# EAGLE design multicharger-redux (EAGLE 9.6.2)
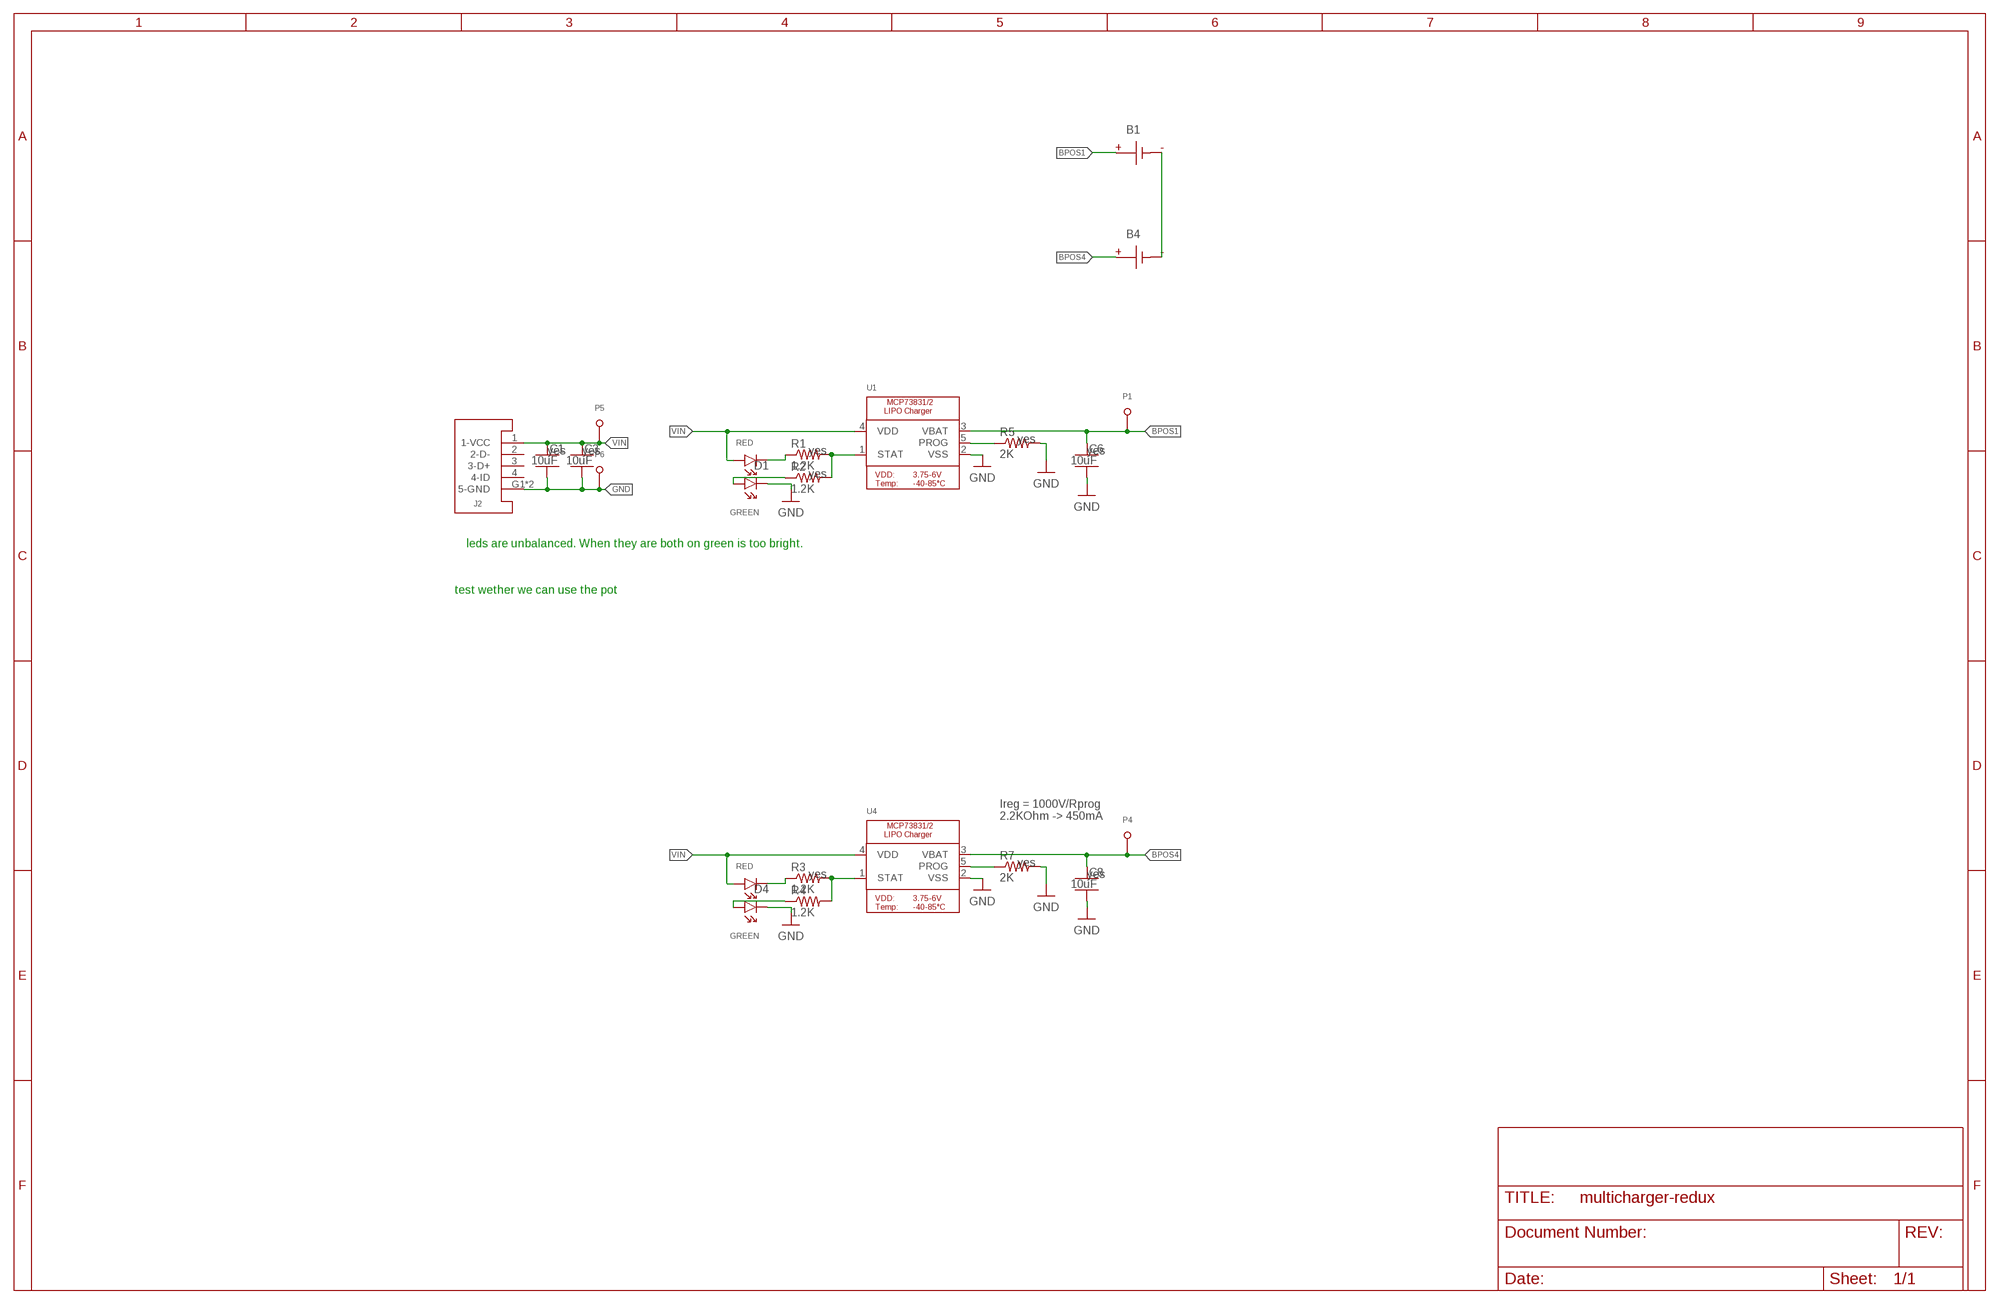
[diagram p0: schematic, sheet 1]
FRAME1 (FRAME_B_L): CREATOR: Unknown; DIST: Unknown; DISTPN: Unknown

## Parts
B1  BATTERY-SMD  [MOLEX-BATTERY-CONNECTOR-SMD-51005-2P]
B4  BATTERY-SMD  [MOLEX-BATTERY-CONNECTOR-SMD-51005-2P]
C1  10uF  CAPACITOR-NP_SMD-2012-0805_CERAMIC-10UF  [CAPC2012X140_HS]
C3  10uF  CAPACITOR-NP_SMD-2012-0805_CERAMIC-10UF  [CAPC2012X140_HS]
C6  10uF  CAPACITOR-NP_SMD-2012-0805_CERAMIC-10UF  [CAPC2012X140_HS]
C8  10uF  CAPACITOR-NP_SMD-2012-0805_CERAMIC-10UF  [CAPC2012X140_HS]
D1  LED-2X-GREEN/RED-1.6X1.5MM  [LED-2X-LITE-ON-1.6MMX1.5MM]
D4  LED-2X-GREEN/RED-1.6X1.5MM  [LED-2X-LITE-ON-1.6MMX1.5MM]
J2  USB-A-SMD-KEYSTONE-931  [USB-A-KEYSTONE-931]
P1  TEST-POINT-1MM  [TEST-POINT-1MM-VIA]
P4  TEST-POINT-1MM  [TEST-POINT-1MM-VIA]
P5  TEST-POINT-1MM  [TEST-POINT-1MM-VIA]
P6  TEST-POINT-1MM  [TEST-POINT-1MM-VIA]
R1  1.2K  RESISTOR_SMD-2012-0805-1.2K  [RESC2012X60_HS]
R2  1.2K  RESISTOR_SMD-2012-0805-1.2K  [RESC2012X60_HS]
R3  1.2K  RESISTOR_SMD-2012-0805-1.2K  [RESC2012X60_HS]
R4  1.2K  RESISTOR_SMD-2012-0805-1.2K  [RESC2012X60_HS]
R5  2K  RESISTOR_SMD-2012-0805-2K  [RESC2012X60_HS]
R7  2K  RESISTOR_SMD-2012-0805-2K  [RESC2012X60_HS]
U1  MCP73831T-2ACI/OT  MCP73831/2  [SOT23-5]
U4  MCP73831T-2ACI/OT  MCP73831/2  [SOT23-5]

## Nets
BPOS1 [LONG_PWR]: B1.P C6.1 P1.T U1.3(VBAT)
BPOS4 [LONG_PWR]: B4.P C8.1 P4.T U4.3(VBAT)
GND [LONG_PWR]: B1.G2(N) B1.G3(N) B1.G(N) B4.G2(N) B4.G3(N) B4.G(N) C1.2 C3.2 C6.2 C8.2 D1.C1 D4.C1 J2.G1(5-GND) J2.G2(5-GND) P6.T R5.2 R7.2 U1.2(VSS) U4.2(VSS)
N$1: D1.A1 R2.1
N$2: D1.C2 R1.1
N$11: R1.2 R2.2 U1.1(STAT)
N$12: R5.1 U1.5(PROG)
N$13: R3.2 R4.2 U4.1(STAT)
N$14: R7.1 U4.5(PROG)
N$15: D4.A1 R4.1
N$16: D4.C2 R3.1
VIN [LONG_PWR]: C1.1 C3.1 D1.A2 D4.A2 J2.1(1-VCC) P5.T U1.4(VDD) U4.4(VDD)
Unconnected: J2.2(2-D-) J2.3(3-D+) J2.4(4-ID)

## Notes on the sheet
- leds are unbalanced. When they are both on green is too bright.
- test wether we can use the pot
- Ireg = 1000V/Rprog
  2.2KOhm -> 450mA

## Library data of the parts
B1 B4 = quadparts_prebuilt:BATTERY: Connections for a battery.; CREATOR: Swanson; DESC: Surface mount battery connector; DIST: ALIBABA; DISTPN: https://www.alibaba.com/product-detail/Molex-51005-51006-2-pin-female_60863668004.html?spm=a2700.7724857.normalList.97.20ef28e64nZnNK; MFR: UNKNOWN; MOUNTING: SMD; MPN: UNKNOWN
C1 C3 C6 C8 = quadparts_prebuilt:CAPACITOR-NP_: Nonpolarized capacitor; CREATOR: Swanson; DESC: CAP CER 10UF 25V X5R 0805; DIST: Digikey; DISTPN: 445-5984-1-ND; MFR: TDK; MOUNTING: SMD; MPN: C2012X5R1E106K125AB; REVIEWER: Swanson; SUBSTITUTE_OK: yes
D1 D4 = RemoteParts:LED-2X; COLOR1: RED; COLOR2: GREEN; CREATOR: Swanson; DESC: LED GREEN/RED CLEAR CHIP SMD; DIST: DIGIKEY; DISTPN: 160-2252-1-ND; MFR: Lite-On Inc.; MOUNTING: SMD; MPN: LTST-C195TGKRKT; PACKAGE: 4SMD
J2 = RemoteParts:USB; CREATOR: Swanson; DESC: CONN PLUG USB2.0 TYPEA 4P SMD RA; DIST: DIGIKEY; DISTPN: 36-931-ND; MFR: Keystone Electronics; MOUNTING: SMD; MPN: 931
P1 P4-P6 = RemoteParts:TEST-POINT; CREATOR: Swanson; DIST: NA; DISTPN: NA; MOUNTING: NA; POPULATE: NO
R1-R3 = quadparts_prebuilt:RESISTOR_: Resistor; CREATOR: Swanson; DESC: RES SMD 1.2K OHM 1% 1/8W 0805; DIST: DIGIKEY; DISTPN: 311-1.20KCRCT-ND; MFR: Yageo; MOUNTING: SMD; MPN: RC0805FR-071K2L; PACKAGE: 0805; SUBSTITUTE_OK: yes
R4 = quadparts_prebuilt:RESISTOR_: Resistor; CREATOR: Swanson; DESC: RES SMD 1.2K OHM 1% 1/8W 0805; DIST: DIGIKEY; DISTPN: 311-1.20KCRCT-ND; MFR: Yageo; MOUNTING: SMD; MPN: RC0805FR-071K2L; PACKAGE: 0805
R5 R7 = quadparts_prebuilt:RESISTOR_: Resistor; CREATOR: Swanson; DESC: RES SMD 1.2K OHM 1% 1/8W 0805; DIST: DIGIKEY; DISTPN: YAG3700CT-ND; MFR: YAGEO; MOUNTING: SMD; MPN: AC0805FR-071K2L; PACKAGE: 0805; SUBSTITUTE_OK: yes
U1 U4 = RemoteParts:MCP73831/2: MCP73831/2 LIPO Charger VDD: 3.75 - 6V Temp -40 - 85°C Programmable Charge Rate: 15-500mA NOTE: STAT is a tri-state logic output on the MCP73831 and an open-drain output on the MCP73832. SOT23-5 with 4.2V output and tri-state logic on STAT = MCP73831T-2ACI/OT; CREATOR: Adafruit; DESC: IC CONTROLLR LI-ION 4.2V SOT23-5; DIST: DIGIKEY; DISTPN: MCP73831T-2ACI/OTCT-ND; MFR: Microchip Technology; MOUNTING: SMD; MPN: MCP73831T-2ACI/OT; PACKAGE: SOT23-5

## Net classes
1 HIGH-I: drill 0.254 mm
3 PWR: drill 0.381 mm
4 LONG_PWR: width 0.508 mm, drill 0.381 mm

## Board
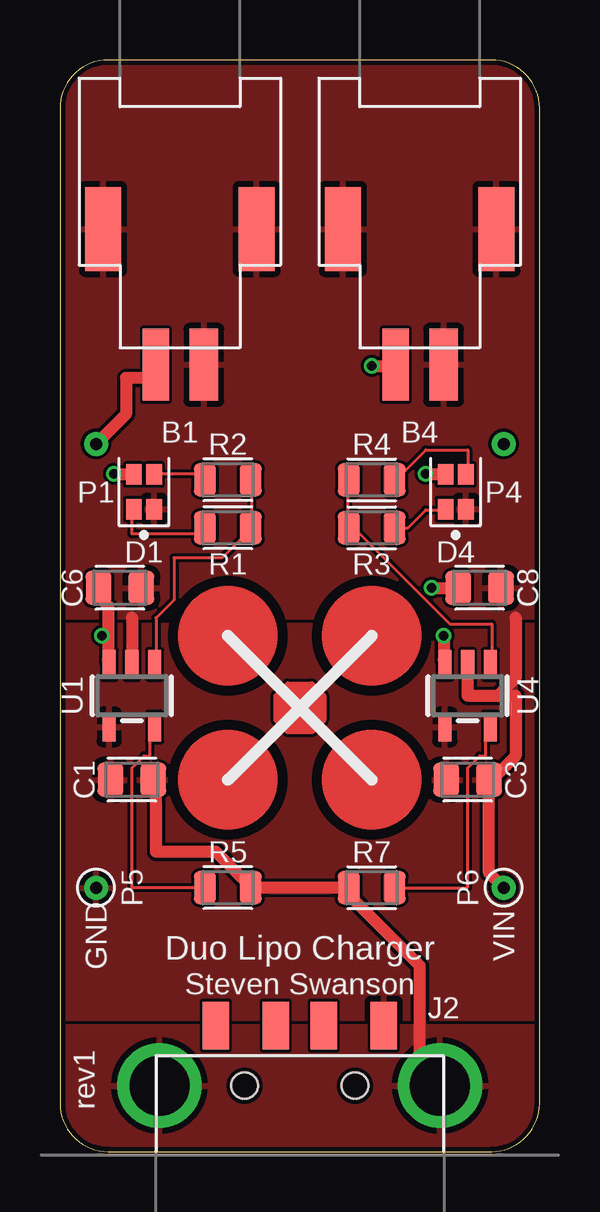
[diagram p1: board, top side]
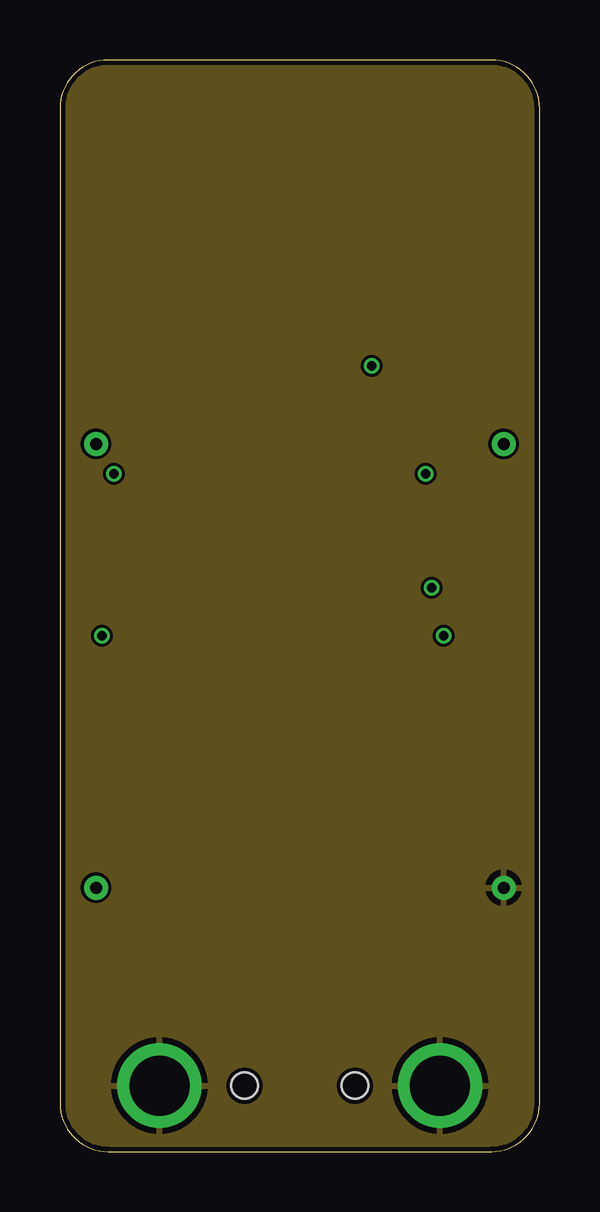
[diagram p2: board, inner layer Route2]
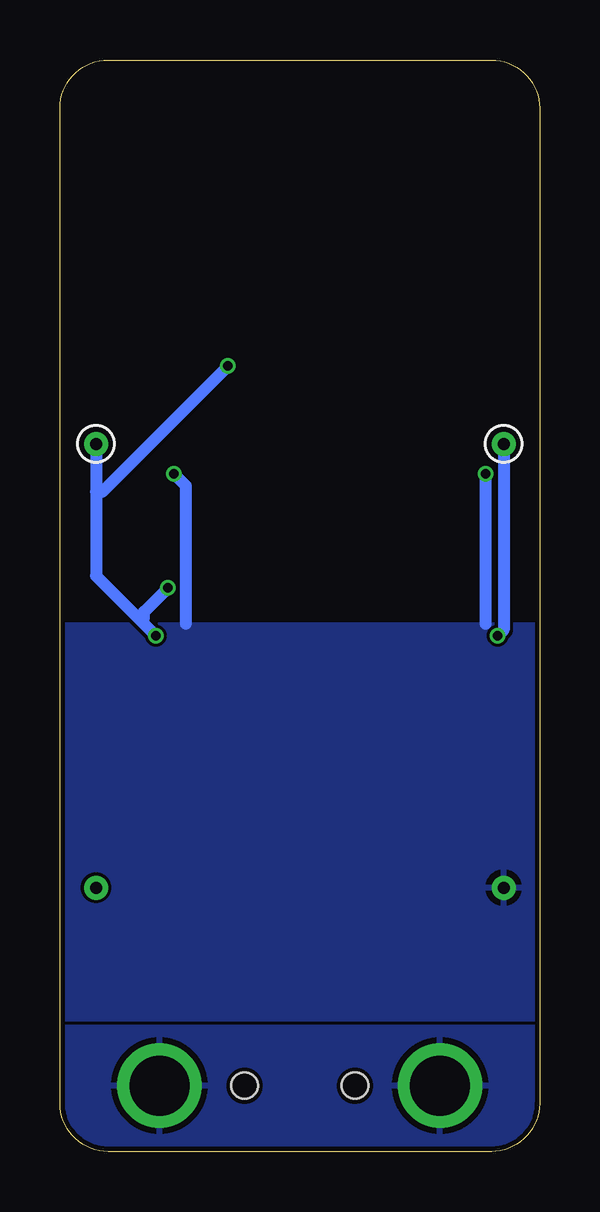
[diagram p3: board, bottom side, seen from below]

Size 20 x 45.5 mm. Coordinates in mm from the lower left corner, seen from the top.
Outline: 0,43.5 0,2 arc90 2,0 18,0 arc90 20,2 20,43.5 arc90 18,45.5 2,45.5 arc90 0,43.5
Copper layers (1*2*15*16): Top 0.035559375mm / dielectric 1.501140625mm / Route2 0.035559375mm / dielectric 0.149859375mm / Route15 0.035559375mm / dielectric 0.200659375mm / Bottom 0.035559375mm
Design rules "jlcpcb-4layer-5mil-small-cream": minimum track width 5mil, minimum drill 0.2mm, track to track 5mil, track to pad 5mil, pad to pad 5mil, via to via 5mil, smd to smd 5mil, copper to edge 0.2mm, drill to drill 10mil, minimum pad ring 3mil, minimum via ring 5mil, stop-mask expansion 0.05mm, vias tented up to drill 0.45mm, thermal gap 10mil

### Footprints (pad centres in the part's own frame; a part is rotated, then mirrored left to right if it is on the bottom)
MOLEX-BATTERY-CONNECTOR-SMD-51005-2P = smd 1.2 x 3: G -1,5.2 | smd 1.5 x 3.5: G2 -3.2,-0.45; G3 3.2,-0.45 | smd 1.1 x 3: P 1,5.2
CAPC2012X140_HS = smd 1.08 x 1.42: 1 -0.895,0; 2 0.895,0
LED-2X-LITE-ON-1.6MMX1.5MM = smd 0.85 x 0.65: A1 -0.725,0.425; A2 -0.725,-0.425; C1 0.725,0.425; C2 0.725,-0.425
USB-A-KEYSTONE-931 = smd 1.1 x 1.99: 1 -3.5,-1.25; 2 -1,-1.25; 3 1,-1.25; 4 3.5,-1.25 | drill 2.5: G1 -5.85,1.25; G2 5.85,1.25 | hole 1.1: -2.3,1.25; 2.3,1.25
TEST-POINT-1MM-VIA = drill 0.5 pad 1: T 0,0
RESC2012X60_HS = smd 0.92 x 1.38: 1 -0.955,0; 2 0.955,0
SOT23-5 = smd 0.55 x 1.2: 1 -0.95,-1.3; 2 0,-1.3; 3 0.95,-1.3; 4 0.95,1.3; 5 -0.95,1.3

### Placement (x,y rotation side)
B1  5,38 180 top
B4  15,38 180 top
C1  3,15.5 0 top
C3  17,15.5 0 top
C6  2.5,23.5 0 top
C8  17.5,23.5 0 top
D1  3.5,27.5 270 top
D4  16.5,27.5 270 top
J2  10,4 180 top
P1  1.5,29.5 0 bottom
P4  18.5,29.5 0 bottom
P5  1.5,11 90 top
P6  18.5,11 270 top
R1  7,26 0 top
R2  7,28 0 top
R3  13,26 180 top
R4  13,28 180 top
R5  7,11 0 top
R7  13,11 180 top
U1  3,19 180 top
U4  17,19 180 top
U$2  [QUADCLASS_LOGO]  10,18.5 0 top

### Tracks (layer width: path | path; a pad name or v marks a point on that pad's centre or on a via)
BPOS1  (via drill 0.38)
  Top 0.508: 2,21.5 2,22.75 1.75,23 1.75,23.5 C6.1 | 2,21.5 2,20.5 U1.3 | P1.T 2.75,30.75 2.75,32.25 3.5,32.25 4,32.75 B1.P | v1.75,21.5 2,21.5
  Bottom 0.508: v1.75,21.5 1.5,21.75 P1.T
BPOS4  (via drill 0.38)
  Top 0.508: v16,21.5 16,20.5 U4.3 | v15.5,23.5 C8.1 | v13,32.75 14,32.75 B4.P
  Bottom 0.508: 16.62,22.12 18.5,24 18.5,27.5 | 16.62,22.12 v16,21.5 | P4.T 18.5,27.5 | v15.5,23.5 16.5,22.5 16.5,22.25 16.62,22.12 | v13,32.75 18.25,27.5 18.5,27.5
GND
  Top 0.508: 3,22.25 U1.2 | U4.2 17,19 18.25,19 | 18.25,19 19,19.75 19,22.25 | 18.25,19 19,19 19,16.5 18,15.5 C3.2 17.89,11.61 P6.T | C1.2 4,15.5 4,12.5 6.5,12.5 7.75,11.25 8,11.25 R5.2 R7.2 12,10.75 15,7.75 15,2.75 J2.G1 | B4.G2 18.25,38.5 18.26,38.39
  pour Bottom (rank 2): -0.5,46.5 -0.5,-1 21,-1 21,46.5
  pour Top (rank 3): -1,47 -1,-1.5 21.5,-1.5 21.5,47
  pour Route2: -1.5,47.5 -1.5,-2 22,-2 22,47.5
N$1
  Top 0.127: D1.A1 4,28.25 5.75,28.25 6,28 R2.1
N$2
  Top 0.127: D1.C2 3,26.75 3,25.75 5.75,25.75 6,26 R1.1
N$11
  Top 0.127: 8,26 6.75,24.75 4.75,24.75 4.75,23 4,22.25 4,20.5 U1.1 | 8,26 8,28 R2.2 | 8,26 R1.2
N$12
  Top 0.127: R5.1 3,11 3,16 3.5,16.5 3.75,16.5 3.75,17.5 U1.5
N$13
  Top 0.127: U4.1 18,20.5 18,22 16.25,22 12.25,26 R3.2 12,26 12,28 R4.2
N$14
  Top 0.127: R7.1 17,11 17,16 17.5,16.5 17.75,16.5 17.75,17.5 U4.5
N$15
  Top 0.127: D4.A1 17,28.25 17,29.25 15.25,29.25 14,28 R4.1
N$16
  Top 0.127: R3.1 14.5,26 15.25,26.75 16,26.75 D4.C2
VIN  (via drill 0.38)
  Top 0.508: v2.25,28.25 3,28.25 D1.A2 | v15.25,28.25 16,28.25 D4.A2
  Bottom 0.508: 2.25,22 v2.25,28.25 | v15.25,28.25 14.75,27.75 14.75,22
  pour Bottom: -2.5,22 23,22 23,5.5 -2.5,5.5
  pour Top (rank 2): -3,22 23.5,22 23.5,5.5 -3,5.5

### Text on the board
tPlace: GND | VIN | Duo Lipo Charger | Steven Swanson | rev1